# EAGLE design 5V_3.3V_Rail (EAGLE 8.3.2)
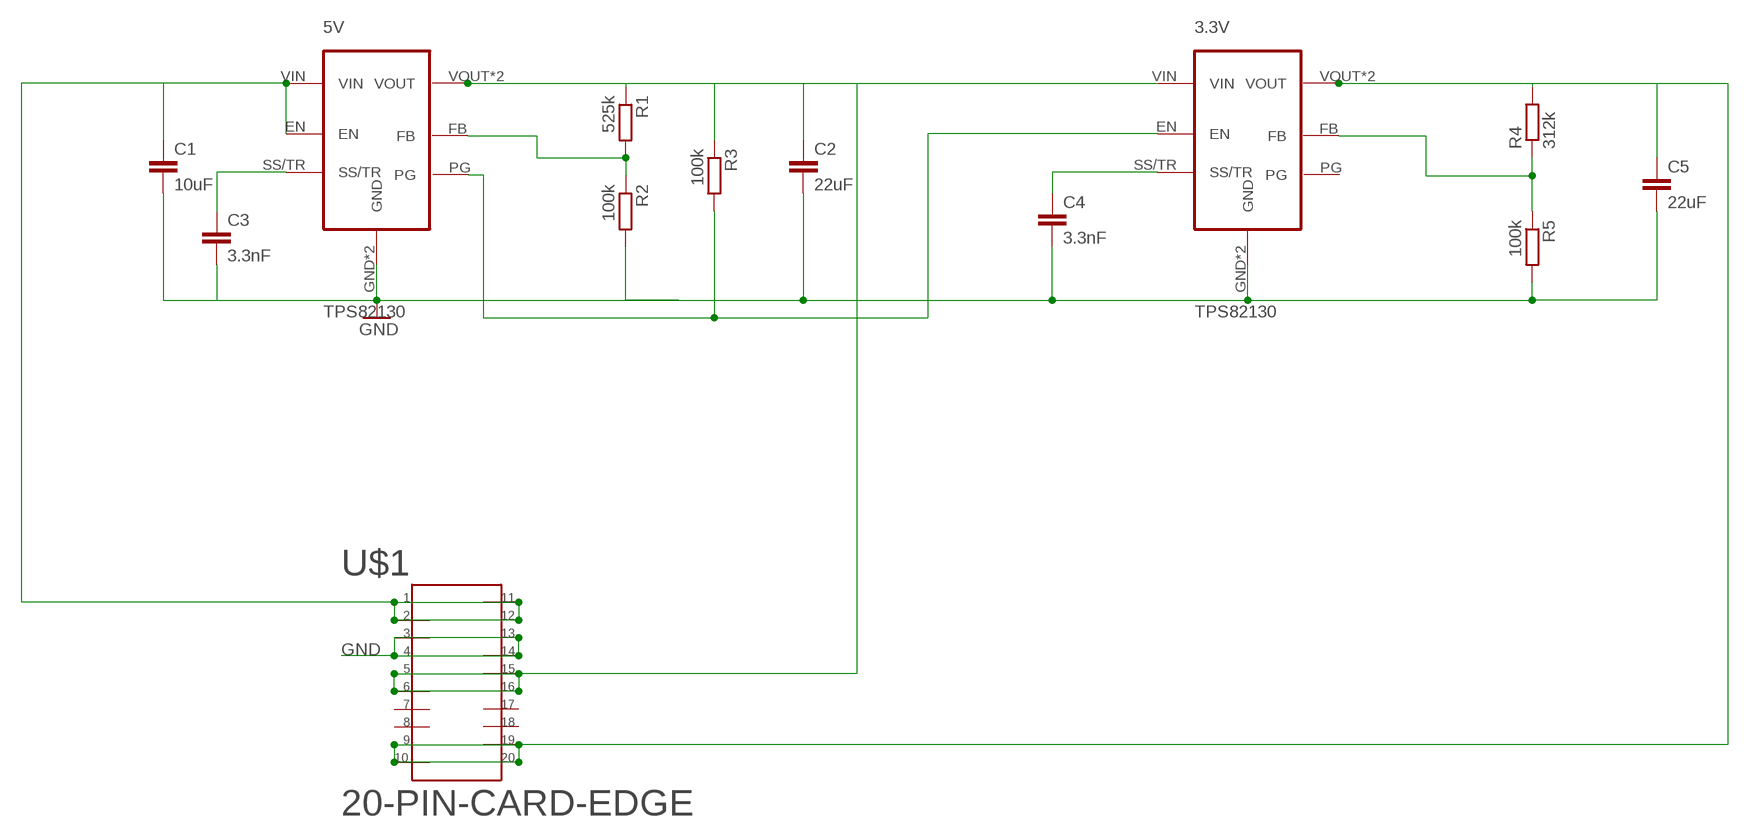
[diagram p0: schematic, sheet 1]

## Parts
3.3V  TPS82130  [TPS82130]
5V  TPS82130  [TPS82130]
C1  10uF  C-EUC0603  [C0603]
C2  22uF  C-EUC0603  [C0603]
C3  3.3nF  C-EUC0603  [C0603]
C4  3.3nF  C-EUC0603  [C0603]
C5  22uF  C-EUC0603  [C0603]
R1  525k  R-EU_R0603  [R0603]
R2  100k  R-EU_R0603  [R0603]
R3  100k  R-EU_R0603  [R0603]
R4  312k  R-EU_R0603  [R0603]
R5  100k  R-EU_R0603  [R0603]
U$1  20-PIN-CARD-EDGE  [20-PIN-CARD-EDGE]

## Nets
FB: 5V.FB R1.2 R2.1
FB2: 3.3V.FB R4.1 R5.1
GND: 3.3V.GND 3.3V.GND_PAD(GND) 5V.GND 5V.GND_PAD(GND) C1.2 C2.2 C3.2 C4.2 C5.2 R2.2 R5.2 U$1.P$3 U$1.P$4 U$1.P$13 U$1.P$14
PG: 3.3V.EN 5V.PG R3.2
SS2: 3.3V.SS/TR C4.1
SS/TR: 5V.SS/TR C3.1
VIN: 5V.EN 5V.VIN C1.1 U$1.P$1 U$1.P$2 U$1.P$11 U$1.P$12
VOUT1: 3.3V.VIN 5V.VOUT 5V.VOUT_2(VOUT) C2.1 R1.1 R3.1 U$1.P$5 U$1.P$6 U$1.P$15 U$1.P$16
VOUT2: 3.3V.VOUT 3.3V.VOUT_2(VOUT) C5.1 R4.2 U$1.P$9 U$1.P$10 U$1.P$19 U$1.P$20
Unconnected: 3.3V.PG U$1.P$7 U$1.P$8 U$1.P$17 U$1.P$18

## Library data of the parts
3.3V 5V = TPS82130:TPS82130
C1-C5 = rcl:C-EU: CAPACITOR, European symbol
R1-R5 = rcl:R-EU_: RESISTOR, European symbol
U$1 = 20-PIN-CARD-EDGE:20-PIN-CARD-EDGE

## Board
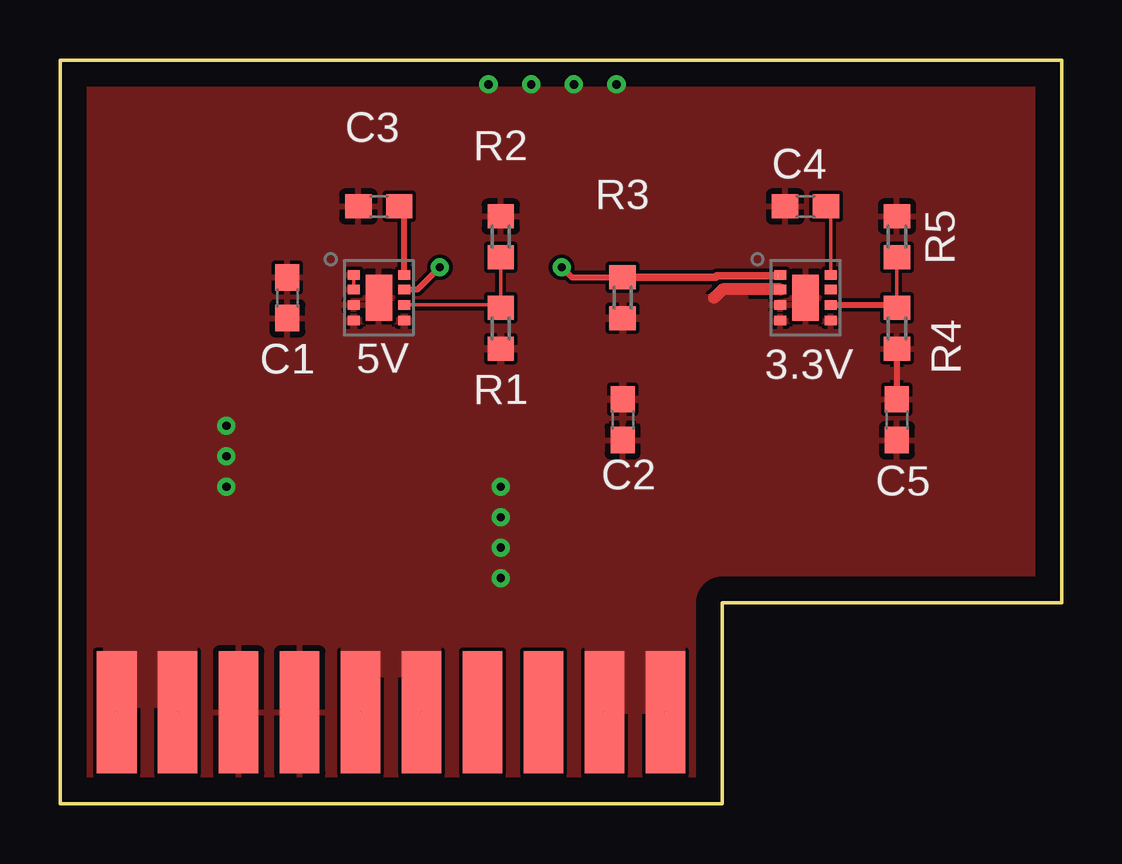
[diagram p1: board, top side]
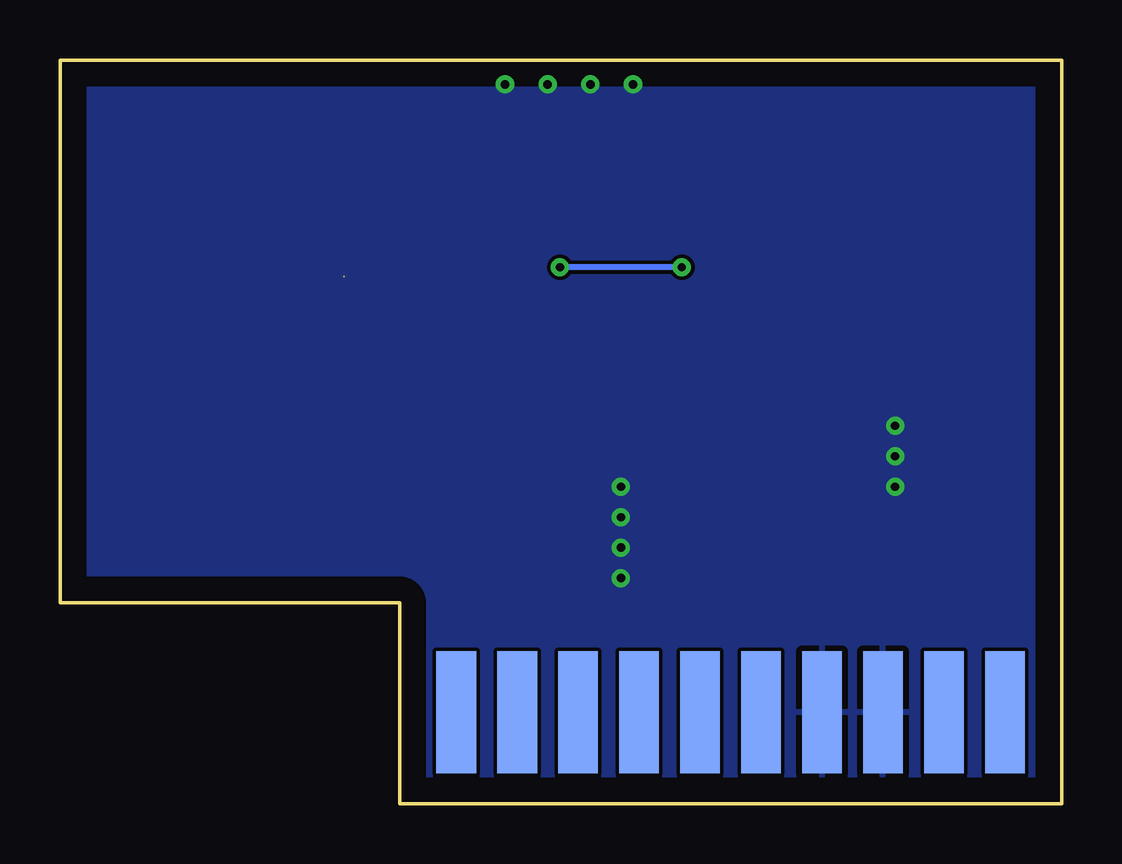
[diagram p2: board, bottom side, seen from below]

Size 41.73 x 30.99 mm. Coordinates in mm from the lower left corner, seen from the top.
Outline: 0,30.99 41.73,30.99 41.73,8.38 27.58,8.38 27.58,0 0,0 0,30.99
Copper layers (1*16): Top 0.035mm / dielectric 1.5mm / Bottom 0.035mm
Design rules "default": minimum track width 6mil, minimum drill 0.35mm, track to track 6mil, track to pad 6mil, pad to pad 6mil, via to via 6mil, smd to smd 6mil, copper to edge 40mil, drill to drill 6mil, minimum pad ring 10mil, minimum via ring 8mil, stop-mask expansion 4mil, vias tented up to drill 0mil, thermal gap 10mil

### Footprints (pad centres in the part's own frame; a part is rotated, then mirrored left to right if it is on the bottom)
TPS82130 = smd 0.5 x 0.4: EN -1.05,0.95; FB 1.05,-0.3; GND -1.05,-0.3; PG 1.05,0.35; SS/TR 1.05,0.95; VIN -1.05,0.35; VOUT -1.05,-0.95; VOUT_2 1.05,-0.95 | smd 1.1 x 1.9: GND_PAD 0,0
C0603 = smd 1.1 x 1: 1 -0.85,0; 2 0.85,0
R0603 = smd 1 x 1.1: 1 -0.85,0; 2 0.85,0
20-PIN-CARD-EDGE = smd 1.651 x 5.08: P$1 0,0; P$2 2.54,0; P$3 5.08,0; P$4 7.62,0; P$5 10.16,0; P$6 12.7,0; P$7 15.24,0; P$8 17.78,0; P$9 20.32,0; P$10 22.86,0 | smd 1.651 x 5.08 bottom: P$11 0,0; P$12 2.54,0; P$13 5.08,0; P$14 7.62,0; P$15 10.16,0; P$16 12.7,0; P$17 15.24,0; P$18 17.78,0; P$19 20.32,0; P$20 22.86,0

### Placement (x,y rotation side)
3.3V  31.06,21.08 0 top
5V  13.28,21.08 0 top
C1  9.47,21.08 270 top
C2  23.44,16 270 top
C3  13.28,24.89 180 top
C4  31.06,24.89 180 top
C5  34.87,16 270 top
R1  18.36,19.81 90 top
R2  18.36,23.62 90 top
R3  23.44,21.08 90 top
R4  34.87,19.81 270 top
R5  34.87,23.62 90 top
U$1  2.36,3.81 0 top

### Tracks (layer width: path | path; a pad name or v marks a point on that pad's centre or on a via)
FB
  Top 0.152: R2.1 R1.2 18.24,20.78 5V.FB
FB2
  Top 0.152: R4.1 R5.1
  Top 0.254: 3.3V.FB 34.75,20.78 R4.1
GND  (via drill 0.35)
  other vias: 17.86,29.97 19.63,29.97 21.41,29.97 23.19,29.97 18.36,13.21 18.36,11.94 18.36,10.67 18.36,9.4 6.93,15.75 6.93,14.48 6.93,13.21
  pour Top: 0.08,31.24 41.99,31.24 41.99,8.13 28.02,8.13 28.02,7.87 28.02,-0.25 -0.18,-0.25 -0.18,31.24
  pour Bottom: 0.33,30.73 41.48,30.73 41.48,8.64 27.25,8.64 27.25,0.25 0.33,0.25
PG  (via drill 0.35)  (1 unrouted)
  Top 0.152: 3.3V.EN 29.91,21.93
  Top 0.254: 5V.PG 14.9,21.43 v15.82,22.35 | R3.2 21.32,21.93 v20.9,22.35
  Top 0.305: R3.2 27.31,21.93 27.37,21.99 29.91,21.99
  Bottom 0.254: v15.82,22.35 v20.9,22.35
SS2
  Top 0.152: 3.3V.SS/TR 32.11,24.69 C4.1
SS/TR
  Top 0.152: 14.33,24.69 C3.1
  Top 0.254: 5V.SS/TR 14.33,24.69
VIN  (2 unrouted)
  Top 0.152: 5V.VIN 5V.EN
  pour Top: 1.85,9.4 1.85,26.16 8.2,26.16 12.01,22.35 12.01,21.08 5.66,21.08 5.66,9.4
  pour Top (no thermals): 1.85,10.67 5.66,10.67 5.66,4.06 1.85,4.06
VOUT1  (2 unrouted)
  Top 0.508: 3.3V.VIN 27.6,21.43 27.25,21.08
  pour Top: 20.9,20.32 22.17,21.08 28.52,21.08 28.52,17.27 27.25,16 10.74,16 10.74,20.32
  pour Top (no thermals): 11.76,16.51 11.76,5.33 15.82,5.33 15.82,16.51
VOUT2  (2 unrouted)
  Top 0.254: R4.2 C5.1
  pour Top: 29.79,20.32 36.14,20.32 36.14,16.51 29.79,16.51
  pour Top (no thermals): 29.79,17.02 29.79,10.92 21.92,10.92 21.92,3.81 25.98,3.81 25.98,9.14 33.1,9.14 33.1,17.02